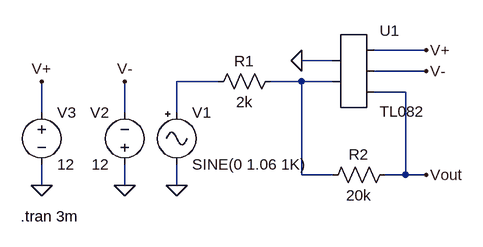
[diagram p0: schematic TL082.asc]
TL082.asc, the LTspice schematic file:
Version 4
SHEET 1 880 680
WIRE 400 32 320 32
WIRE 256 48 208 48
WIRE 400 64 320 64
WIRE 80 80 16 80
WIRE 208 80 160 80
WIRE 256 80 208 80
WIRE 368 96 320 96
WIRE -192 128 -192 80
WIRE -64 128 -64 80
WIRE 16 128 16 80
WIRE 208 224 208 80
WIRE 256 224 208 224
WIRE 368 224 368 96
WIRE 368 224 336 224
WIRE 400 224 368 224
WIRE -192 240 -192 208
WIRE -64 240 -64 208
WIRE 16 240 16 208
FLAG 208 48 0
FLAG 400 32 V+
FLAG 400 64 V-
FLAG 16 240 0
FLAG -64 240 0
FLAG -192 240 0
FLAG -64 80 V-
FLAG -192 80 V+
FLAG 400 224 Vout
SYMBOL res 176 64 R90
WINDOW 0 0 56 VBottom 2
WINDOW 3 32 56 VTop 2
SYMATTR InstName R1
SYMATTR Value 2k
SYMBOL res 352 208 R90
WINDOW 0 0 56 VBottom 2
WINDOW 3 32 56 VTop 2
SYMATTR InstName R2
SYMATTR Value 20k
SYMBOL Misc\\signal 16 112 R0
WINDOW 123 0 0 Left 0
WINDOW 39 0 0 Left 0
SYMATTR InstName V1
SYMATTR Value SINE(0 1.06 1K)
SYMBOL voltage -64 224 R180
WINDOW 0 24 96 Left 2
WINDOW 3 24 16 Left 2
WINDOW 123 0 0 Left 0
WINDOW 39 0 0 Left 0
SYMATTR InstName V2
SYMATTR Value 12
SYMBOL voltage -192 112 R0
WINDOW 123 0 0 Left 0
WINDOW 39 0 0 Left 0
SYMATTR InstName V3
SYMATTR Value 12
SYMBOL AutoGenerated\\TL082 288 64 R0
SYMATTR InstName U1
TEXT -224 288 Left 2 !.tran 3m

The netlist it stands for:
* TL082.asc
R1 N002 N001 2k
R2 Vout N002 20k
V1 N001 0 SINE(0 1.06 1K)
V2 0 V- 12
V3 V+ 0 12
* U1: TL082 (symbol AutoGenerated\TL082 not available, pins judged from their places): pin1=0 pin2=N002 pin3=V+ pin4=V- pin5=Vout
.tran 3m
.backanno
.end